# Altium project Open Source Programmable Load.PrjPcb (part 2 of 2)

## Sheet Power.SchDoc
size 431 x 279 mm; SheetNumber: 6; SheetTotal: 6
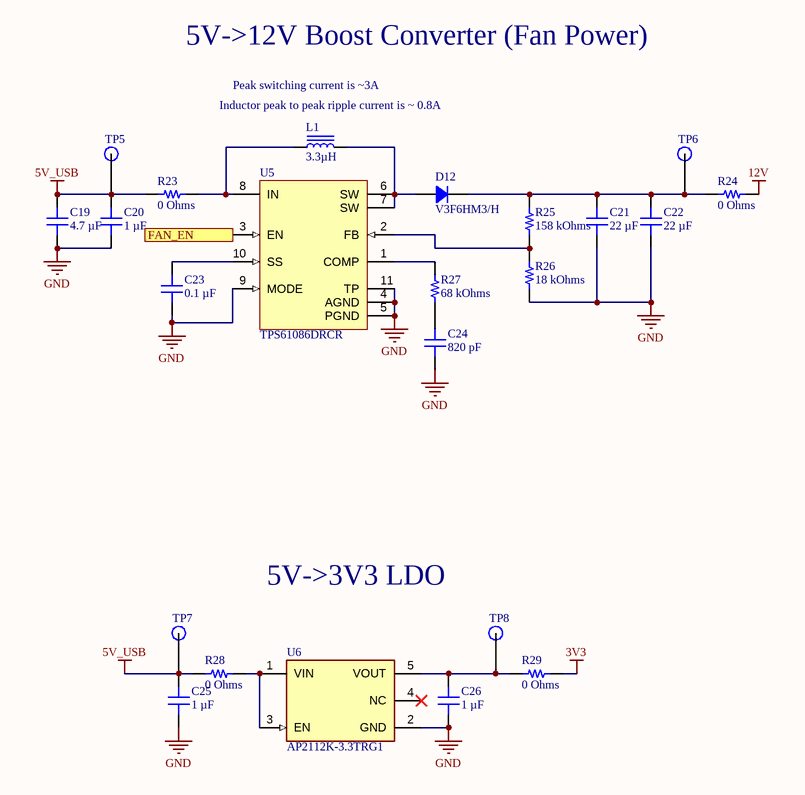
[diagram p4: Power.SchDoc]

### Parts
C19  4.7 µF  [CAP 0603_1608]
C20  1 µF  [CAP 0805_2012]
C21  22 µF  [CAP 1206_3216 - 0.8MM]
C22  22 µF  [CAP 1206_3216 - 0.8MM]
C23  0.1 µF  [CAP 0603_1608]
C24  820 pF  [CAP 0603_1608]
C25  1 µF  [CAP 0603_1608]
C26  1 µF  [CAP 0603_1608]
D12  V3F6HM3/H  [SMF DO-219AB]
L1  3.3µH  [IND 1008_2520]
R23  0 Ohms  [RES 0603_1608]
R24  0 Ohms  [RES 0603_1608]
R25  158 kOhms  [RES 0603_1608]
R26  18 kOhms  [RES 0603_1608]
R27  68 kOhms  [RES 0603_1608]
R28  0 Ohms  [RES 0603_1608]
R29  0 Ohms  [RES 0603_1608]
TP5  1.5mm Test Point  [1mm Test Point-Footprint-1]  (value not drawn)
TP6  1.5mm Test Point  [1mm Test Point-Footprint-1]  (value not drawn)
TP7  1.5mm Test Point  [1mm Test Point-Footprint-1]  (value not drawn)
TP8  1.5mm Test Point  [1mm Test Point-Footprint-1]  (value not drawn)
U5  TPS61086DRCR  [DRC0010A_V]
U6  AP2112K-3.3TRG1  [FP-SOT25-IPC_A]

### Ports
FAN_EN (in)

### Nets
3V3: R29.2
5V_USB: C19.2 C20.2 C25.2 R23.1 R28.1 TP5.1 TP7.1
12V: R24.2
GND: C19.1 C20.1 C21.1 C22.1 C23.1 C24.1 C25.1 C26.1 R26.1 U5.4(AGND) U5.5(PGND) U5.9(MODE) U5.11(TP) U6.2(GND)
NetC21_2: C21.2 C22.2 D12.2 R24.1 R25.2 TP6.1
NetC23_2: C23.2 U5.10(SS)
NetC24_2: C24.2 R27.1
NetC26_2: C26.2 R29.1 TP8.1 U6.5(VOUT)
NetD12_1: D12.1 L1.2 U5.6(SW) U5.7(SW)
NetL1_1: L1.1 R23.2 U5.8(IN)
NetR25_1: R25.1 R26.2 U5.2(FB)
NetR27_2: R27.2 U5.1(COMP)
NetR28_2: R28.2 U6.1(VIN) U6.3(EN)
NetU5_3: U5.3(EN) ; port FAN_EN

Not connected (* = marked no-connect by the designer): U6 4(NC)*

### Notes on the sheet
- 5V->12V Boost Converter (Fan Power)
- (near L1) Inductor peak to peak ripple current is ~ 0.8A
- Peak switching current is ~3A
- 5V->3V3 LDO
- DWG. NO.
- REV.
- SHT.
- THIS DOCUMENT AND THE DATA DISCLOSED HEREIN OR HEREWITH IS THE PROPERTY OF ALTIUM LIMITED AND MAY BE FREELY DISTRIBUTED IN WHOLE. NO RIGHTS ARE RESERVED OR EXPRESS OR IMPLIED WARANTEE GIVEN.
- REVISION
- DESCRIPTION
- DATE
- APPROVED
- ENG:
- APPROVALS
- PROJECT
- DSN:
- CHK:
- REFERENCE DOCUMENTS
- PROJECT REVISION:
- TITLE
- DOCUMENT REVISION:
- DESIGN ITEM:
- BOM:
- FAB DWG:
- PCB DWG:
- ASSY DWG:
- SCALE:
- SIZE
- B
- CAGE CODE
- FILE NAME
- DWG NO.
- SHEET
- OF
- REV

### Library data of the parts
C19 = CL10A475KP8NNNC: CAP CER 4.7UF 10V X5R 0603; manufacturer: Samsung Electro-Mechanics; Tolerance: ±10%; Part Number: CL10A475KP8NNNC; Value: 4.7 µF; Applications: General Purpose; Capacitance: 4.7 µF; componentlink1description: Datasheet; componentlink1url: http://www.samsungsem.com/kr/support/product-search/mlcc/CL10A475KP8NNNC.jsp; componentlink2description: DigiKey Link; componentlink2url: https://www.digikey.com/en/products/detail/samsung-electro-mechanics/CL10A475KP8NNNC/3886702; Device Package: 0603 (1608 Metric); lastupdated: 2022-09-13 6:40:44 AM; Lifecycle Status: Active; Minimum Order: 1; Mounting Type: Surface Mount, MLCC; Operating Temperature: -55°C ~ 85°C; Package / Case: 0603 (1608 Metric); packaging: TapeAndReel; partid: 5671; Part Status: Active; price: 0.01; series: CL; Size / Dimension: 0.063" L x 0.031" W (1.60mm x 0.80mm); Supplier 1: DigiKey; Supplier Part Number 1: 1276-1044-1-ND; Temperature Coefficient: X5R; Thickness (Max): 0.035" (0.90mm); Voltage - Rated: 10V
C20 = GCJ21BR71H105KA01L: CAP CER 1UF 50V X7R 0805; manufacturer: Murata Electronics; Tolerance: ±10%; Part Number: GCJ21BR71H105KA01L; Value: 1 µF; Applications: Automotive, Boardflex Sensitive; Capacitance: 1 µF; componentlink1description: Datasheet; componentlink1url: https://www.murata.com/~/media/webrenewal/support/library/catalog/products/capacitor/mlcc/c03e.ashx?la=en-us; componentlink2description: DigiKey Link; componentlink2url: https://www.digikey.com/en/products/detail/murata-electronics/GCJ21BR71H105KA01L/4903512; Device Package: 0805 (2012 Metric); Features: Soft Termination; lastupdated: 2023-01-02 8:10:56 PM; Lifecycle Status: Active; Minimum Order: 1; Mounting Type: Surface Mount, MLCC; Operating Temperature: -55°C ~ 125°C; Package / Case: 0805 (2012 Metric); packaging: TapeAndReel; partid: 2709; Part Status: Active; price: 0.06; Ratings: AEC-Q200; series: GCJ; Size / Dimension: 0.079" L x 0.049" W (2.00mm x 1.25mm); Supplier 1: DigiKey; Supplier Part Number 1: 490-10667-1-ND; Temperature Coefficient: X7R; Thickness (Max): 0.057" (1.45mm); Voltage - Rated: 50V
C21 C22 = CL31A226MOCLNNC: CAP CER 22UF 16V X5R 1206; manufacturer: Samsung Electro-Mechanics; Tolerance: ±20%; Part Number: CL31A226MOCLNNC; Value: 22 µF; Applications: General Purpose; Capacitance: 22 µF; componentlink1description: Datasheet; componentlink1url: http://www.samsungsem.com/kr/support/product-search/mlcc/CL31A226MOCLNNC.jsp; componentlink2description: DigiKey Link; componentlink2url: https://www.digikey.com/en/products/detail/samsung-electro-mechanics/CL31A226MOCLNNC/3888386; Device Package: 1206 (3216 Metric); Features: Low Profile; lastupdated: 2023-01-02 8:12:59 PM; Lifecycle Status: Active; Minimum Order: 1; Mounting Type: Surface Mount, MLCC; Operating Temperature: -55°C ~ 85°C; Package / Case: 1206 (3216 Metric); packaging: TapeAndReel; partid: 19106; Part Status: Active; price: 0.04; series: CL; Size / Dimension: 0.126" L x 0.063" W (3.20mm x 1.60mm); Supplier 1: DigiKey; Supplier Part Number 1: 1276-2728-1-ND; Temperature Coefficient: X5R; Thickness (Max): 0.037" (0.95mm); Voltage - Rated: 16V
C23 = C0603C104K5RAC7411: CAP CER 0.1UF 50V X7R 0603; manufacturer: KEMET; Tolerance: ±10%; Part Number: C0603C104K5RAC7411; Value: 0.1 µF; Applications: Bypass, Decoupling; Capacitance: 0.1 µF; componentlink1description: Datasheet; componentlink1url: https://api.kemet.com/component-edge/download/datasheet/C0603C104K5RAC7411.pdf; componentlink2description: DigiKey Link; componentlink2url: https://www.digikey.com/en/products/detail/kemet/C0603C104K5RAC7411/3317013; Device Package: 0603 (1608 Metric); lastupdated: 2022-09-13 6:40:53 AM; Lifecycle Status: Active; Minimum Order: 15000; Mounting Type: Surface Mount, MLCC; Operating Temperature: -55°C ~ 125°C; Package / Case: 0603 (1608 Metric); packaging: TapeAndReel; partid: 2233; Part Status: Active; price: 0.01; series: SMD Comm X7R; Size / Dimension: 0.063" L x 0.031" W (1.60mm x 0.80mm); Supplier 1: DigiKey; Supplier Part Number 1: 399-7374-2-ND; Temperature Coefficient: X7R; Thickness (Max): 0.035" (0.90mm); Voltage - Rated: 50V
C24 = C0603C821K5RACAUTO: CAP CER 820PF 50V X7R 0603; manufacturer: KEMET; Tolerance: ±10%; Part Number: C0603C821K5RACAUTO; Value: 820 pF; Applications: Automotive, Bypass, Decoupling; Capacitance: 820 pF; componentlink1description: Datasheet; componentlink1url: https://api.kemet.com/component-edge/download/datasheet/C0603C821K5RACAUTO.pdf; componentlink2description: DigiKey Link; componentlink2url: https://www.digikey.com/en/products/detail/kemet/C0603C821K5RACAUTO/8572435; Device Package: 0603 (1608 Metric); lastupdated: 2023-01-02 8:07:53 PM; Lifecycle Status: Active; Minimum Order: 1; Mounting Type: Surface Mount, MLCC; Operating Temperature: -55°C ~ 125°C; Package / Case: 0603 (1608 Metric); packaging: TapeAndReel; partid: 3747; Part Status: Active; price: 0.01; Ratings: AEC-Q200; series: SMD Auto X7R; Size / Dimension: 0.063" L x 0.031" W (1.60mm x 0.80mm); Supplier 1: DigiKey; Supplier Part Number 1: 399-17600-1-ND; Temperature Coefficient: X7R; Thickness (Max): 0.034" (0.87mm); Voltage - Rated: 50V
C25 C26 = CC0603KRX7R6BB105: CAP CER 1UF 10V X7R 0603; manufacturer: Yageo; Tolerance: ±10%; Part Number: CC0603KRX7R6BB105; Value: 1 µF; Applications: General Purpose; Capacitance: 1 µF; componentlink1description: Datasheet; componentlink1url: https://www.yageo.com/upload/media/product/productsearch/datasheet/mlcc/UPY-GPHC_X7R_6.3V-to-50V_18.pdf; componentlink2description: DigiKey Link; componentlink2url: https://www.digikey.com/en/products/detail/yageo/CC0603KRX7R6BB105/5195204; Device Package: 0603 (1608 Metric); lastupdated: 2022-09-13 6:40:53 AM; Lifecycle Status: Active; Minimum Order: 1; Mounting Type: Surface Mount, MLCC; Operating Temperature: -55°C ~ 125°C; Package / Case: 0603 (1608 Metric); packaging: TapeAndReel; partid: 2290; Part Status: Active; price: 0.02; series: CC; Size / Dimension: 0.063" L x 0.031" W (1.60mm x 0.80mm); Supplier 1: DigiKey; Supplier Part Number 1: 311-1796-1-ND; Temperature Coefficient: X7R; Thickness (Max): 0.035" (0.90mm); Voltage - Rated: 10V
D12 = V3F6HM3/H: 3A,60V,SMF,TRENCH SKY RECT.; Manufacturer: Vishay Semiconductor Diodes Division; Capacitance @ Vr, F: 310pF @ 4V, 1MHz; Current - Reverse Leakage @ Vr: 600µA @ 60V; Diode Type: Schottky; Speed: Fast Recovery =< 500ns, > 200mA (Io); Voltage - Forward (Vf) (Max) @ If: 620mV @ 3A; Part Number: V3F6HM3/H; ComponentLink1Description: Datasheet; ComponentLink1URL: http://www.vishay.com/docs/87565/v3f6.pdf; ComponentLink2Description: DigiKey Link; ComponentLink2URL: http://digikey.com/product-detail/en/vishay-semiconductor-diodes-division/V3F6HM3-H/V3F6HM3-HGICT-ND/9360098; Current - Average Rectified (Io): 3A; LastUpdated: 2023-01-02 9:00:33 PM; Lifecycle Status: Active; Minimum Order: 1; Mounting Type: Surface Mount; Operating Temperature - Junction: -40°C ~ 150°C; Package / Case: DO-219AB; Packaging: TapeAndReel; PartId: 1309; Part Status: Active; Price: 0.11; Series: Automotive, AEC-Q101, eSMP®, TMBS®; Supplier 1: DigiKey; Supplier Part Number 1: V3F6HM3/HGICT-ND; Supplier Device Package: DO-219AB (SMF); Voltage - DC Reverse (Vr) (Max): 60V
L1 = DFE252010F-3R3M=P2: FIXED IND 3.3UH 1.6A 170 MOHM; Manufacturer: Murata Electronics; Current - Saturation: 2.5A; DC Resistance (DCR): 170mOhm Max; Inductance Frequency - Test: 1MHz; Material - Core: Iron Powder; Shielding: Shielded; Tolerance: ±20%; Part Number: DFE252010F-3R3M=P2; ComponentLink1Description: Datasheet; ComponentLink1URL: https://search.murata.co.jp/Ceramy/image/img/P02/J(E)TE243A-0012_DFE252010F_reference.pdf; ComponentLink2Description: DigiKey Link; ComponentLink2URL: http://digikey.com/product-detail/en/murata-electronics/DFE252010F-3R3M=P2/490-13043-1-ND/5812755; Current Rating (Amps): 1.6A; Device Package: 1008 (2520 Metric); Height - Seated (Max): 0.039" (1.00mm); Inductance: 3.3µH; LastUpdated: 2020-09-02 1:29:31 AM; Lifecycle Status: Active; Minimum Order: 1; Mounting Type: Surface Mount; Operating Temperature: -40°C ~ 125°C; Package / Case: 1008 (2520 Metric); Packaging: TapeAndReel; PartId: 3497; Part Status: Active; Price: 0.23; Series: DFE252010F; Size / Dimension: 0.098" L x 0.079" W (2.50mm x 2.00mm); Supplier 1: DigiKey; Supplier Part Number 1: 490-13043-1-ND; Value: 3.3µH
R23 R24 R28 R29 = TLRZ1JTTD: RES 0 OHM JUMPER 0603; Manufacturer: KOA Speer Electronics, Inc.; Part Number: TLRZ1JTTD; Value: 0 Ohms; ComponentLink1Description: Datasheet; ComponentLink1URL: http://www.koaspeer.com/catimages/Products/TLRZ/TLRZ.pdf; ComponentLink2Description: DigiKey Link; ComponentLink2URL: https://www.digikey.com/en/products/detail/koa-speer-electronics-inc/TLRZ1JTTD/9845493; Composition: Metal Element; Device Package: 0603 (1608 Metric); Features: Automotive AEC-Q200, Current Sense; Height - Seated (Max): 0.022" (0.55mm); LastUpdated: 2023-01-02 8:30:27 PM; Lifecycle Status: Active; Minimum Order: 1; Number of Terminations: 2; Operating Temperature: -55°C ~ 170°C; Package / Case: 0603 (1608 Metric); Packaging: TapeAndReel; PartId: 4851; Part Status: Active; Price: 0.08; Ratings: AEC-Q200; Resistance: 0 Ohms; Series: TLRZ; Size / Dimension: 0.063" L x 0.031" W (1.60mm x 0.80mm); Supplier 1: DigiKey; Supplier Part Number 1: 2019-TLRZ1JTTDCT-ND; Supplier Device Package: 0603; Tolerance: Jumper
R25 = RC0603FR-07158KL: RES 158K OHM 1% 1/10W 0603; Manufacturer: Yageo; Power (Watts): 0.1W, 1/10W; Temperature Coefficient: ±100ppm/°C; Part Number: RC0603FR-07158KL; Value: 158 kOhms; ComponentLink1Description: Datasheet; ComponentLink1URL: https://www.yageo.com/upload/media/product/productsearch/datasheet/rchip/PYu-RC_Group_51_RoHS_L_10.pdf; ComponentLink2Description: DigiKey Link; ComponentLink2URL: https://www.digikey.com/en/products/detail/yageo/RC0603FR-07158KL/726963; Composition: Thick Film; Device Package: 0603 (1608 Metric); Features: Moisture Resistant; Height - Seated (Max): 0.022" (0.55mm); LastUpdated: 2023-01-02 8:30:16 PM; Lifecycle Status: Active; Minimum Order: 1; Number of Terminations: 2; Operating Temperature: -55°C ~ 155°C; Package / Case: 0603 (1608 Metric); Packaging: CutTape; PartId: 7687; Part Status: Active; Price: 0.01; Resistance: 158 kOhms; Series: RC_L; Size / Dimension: 0.063" L x 0.031" W (1.60mm x 0.80mm); Supplier 1: DigiKey; Supplier Part Number 1: 311-158KHRCT-ND; Supplier Device Package: 0603; Tolerance: ±1%
R26 = RMCF0603FT18K0: RES 18K OHM 1% 1/10W 0603; Manufacturer: Stackpole Electronics Inc; Power (Watts): 0.1W, 1/10W; Temperature Coefficient: ±100ppm/°C; Part Number: RMCF0603FT18K0; Value: 18 kOhms; ComponentLink1Description: Datasheet; ComponentLink1URL: https://www.seielect.com/catalog/sei-packaging.pdf; ComponentLink2Description: DigiKey Link; ComponentLink2URL: https://www.digikey.com/en/products/detail/stackpole-electronics-inc/RMCF0603FT18K0/1713690; Composition: Thick Film; Device Package: 0603 (1608 Metric); Features: Automotive AEC-Q200; Height - Seated (Max): 0.022" (0.55mm); LastUpdated: 2023-01-02 8:30:03 PM; Lifecycle Status: Active; Minimum Order: 1; Number of Terminations: 2; Operating Temperature: -55°C ~ 155°C; Package / Case: 0603 (1608 Metric); Packaging: CutTape; PartId: 10797; Part Status: Active; Price: 0.01; Ratings: AEC-Q200; Resistance: 18 kOhms; Series: RMCF; Size / Dimension: 0.061" L x 0.031" W (1.55mm x 0.80mm); Supplier 1: DigiKey; Supplier Part Number 1: RMCF0603FT18K0CT-ND; Supplier Device Package: 0603; Tolerance: ±1%
R27 = CRGP0603F68K: RES 68K OHM 1% 1/4W 0603; Manufacturer: TE Connectivity Passive Product; Power (Watts): 0.25W, 1/4W; Temperature Coefficient: ±100ppm/°C; Part Number: CRGP0603F68K; Value: 68 kOhms; ComponentLink1Description: Datasheet; ComponentLink1URL: https://www.te.com/commerce/DocumentDelivery/DDEController?Action=srchrtrv&DocNm=9-1773463-9&DocType=DS&DocLang=English; ComponentLink2Description: DigiKey Link; ComponentLink2URL: https://www.digikey.com/en/products/detail/te-connectivity-passive-product/CRGP0603F68K/8577040; Composition: Thick Film; Device Package: 0603 (1608 Metric); Features: Pulse Withstanding; Height - Seated (Max): 0.022" (0.55mm); LastUpdated: 2023-01-02 8:30:26 PM; Lifecycle Status: Active; Minimum Order: 1; Number of Terminations: 2; Operating Temperature: -55°C ~ 155°C; Package / Case: 0603 (1608 Metric); Packaging: TapeAndReel; PartId: 5012; Part Status: Active; Price: 0.01; Resistance: 68 kOhms; Series: CRGP; Size / Dimension: 0.063" L x 0.031" W (1.60mm x 0.80mm); Supplier 1: DigiKey; Supplier Part Number 1: A130438CT-ND; Supplier Device Package: 0603; Tolerance: ±1%
TP5-TP8 = CMP-002-00006-1: 1.5mm Test Point 0.75mm hole size
U5 = CMP-0347-00018-4: Boost Voltage Converter with 2.3 to 6 V Input and 2.8 to 18.5 V Output, -40 to 85 degC, 10-Pin SON (DRC), Green (RoHS & no Sb/Br); Manufacturer: Texas Instruments; Vin(Min)(V): 2.3; Vout(Min)(V): 2.8; Regulated Outputs(#): 1; Vout(Max)(V): 18.5; Switching Frequency(Typ)(kHz): 1200; Vin(Max)(V): 6; SubFamily: Step-Up Regulator; PackageDescription: 10-Pin Plastic Small Outline No-Lead, 3 x 3 x 1 mm Body, 0.5 mm Pitch, Exposed Pad; PartNumber: TPS61086DRCR; ComponentLink1URL: http://www.ti.com/general/docs/lit/getliterature.tsp?genericPartNumber=TPS61086&fileType=pdf; ComponentLink2URL: http://www.ti.com/litv/pdf/mpds117k; PackageReference: DRC0010A; PackageVersion: revL, Sep-2011; ComponentLink1Description: Datasheet; Mounting Technology: Surface Mount; Topology: Boost; Eco-Plan: Green (RoHS & no Sb/Br); DatasheetVersion: SLVSA05; ComponentLink2Description: Package Specification
U6 = CMP-12756-000035-1: IC REG LINEAR 3.3V 600MA SOT25; Number of Regulators: 1; Output Type: Fixed; Polarity: Positive; Min Input Voltage: 2.5V; Max Input Voltage: 6V; Accuracy: 1.5%; Quiescent Current: 55uA; Dropout Voltage: 250mV; Min Operating Temperature: -40°C; Length: 3.1mm; Output Current: 600mA; Max Operating Temperature: 85°C; Package Quantity: 1; Output Voltage: 3.3V; Width: 1.7mm; Number of Outputs: 1; Packaging: Tape and Reel; Height: 1.3mm; Lead Free: Lead Free; Max Output Current: 600mA; Case/Package: SOT-23-5; Mount: Surface Mount; Number of Pins: 5

## Sheet Fan Driver.SchDoc
size 431 x 279 mm; SheetNumber: 4; SheetTotal: 6
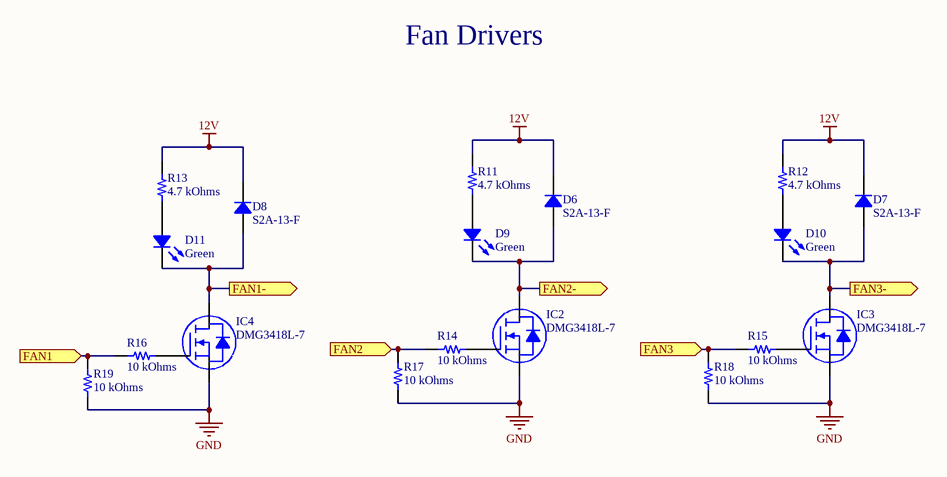
[diagram p5: Fan Driver.SchDoc]

### Parts
D6  S2A-13-F  [DO214AA SMB]
D7  S2A-13-F  [DO214AA SMB]
D8  S2A-13-F  [DO214AA SMB]
D9  Green  [LED 0603_1608 GREEN]
D10  Green  [LED 0603_1608 GREEN]
D11  Green  [LED 0603_1608 GREEN]
IC2  DMG3418L-7  [DIODES SOT-23-3]
IC3  DMG3418L-7  [DIODES SOT-23-3]
IC4  DMG3418L-7  [DIODES SOT-23-3]
R11  4.7 kOhms  [RES 0603_1608]
R12  4.7 kOhms  [RES 0603_1608]
R13  4.7 kOhms  [RES 0603_1608]
R14  10 kOhms  [RES 0603_1608]
R15  10 kOhms  [RES 0603_1608]
R16  10 kOhms  [RES 0603_1608]
R17  10 kOhms  [RES 0603_1608]
R18  10 kOhms  [RES 0603_1608]
R19  10 kOhms  [RES 0603_1608]

### Ports
FAN1 (in), FAN1- (out), FAN2 (in), FAN2- (out), FAN3 (in), FAN3- (out)

### Nets
12V: D6.2 D7.2 D8.2 R11.2 R12.2 R13.2
GND: IC2.2(S) IC3.2(S) IC4.2(S) R17.1 R18.1 R19.1
NetD6_1: D6.1 D9.2 IC2.3(D) ; port FAN2-
NetD7_1: D7.1 D10.2 IC3.3(D) ; port FAN3-
NetD8_1: D8.1 D11.2 IC4.3(D) ; port FAN1-
NetD9_1: D9.1 R11.1
NetD10_1: D10.1 R12.1
NetD11_1: D11.1 R13.1
NetIC2_1: IC2.1(G) R14.1
NetIC3_1: IC3.1(G) R15.1
NetIC4_1: IC4.1(G) R16.1
NetR14_2: R14.2 R17.2 ; port FAN2
NetR15_2: R15.2 R18.2 ; port FAN3
NetR16_2: R16.2 R19.2 ; port FAN1

### Notes on the sheet
- Fan Drivers
- DWG. NO.
- REV.
- SHT.
- THIS DOCUMENT AND THE DATA DISCLOSED HEREIN OR HEREWITH IS THE PROPERTY OF ALTIUM LIMITED AND MAY BE FREELY DISTRIBUTED IN WHOLE. NO RIGHTS ARE RESERVED OR EXPRESS OR IMPLIED WARANTEE GIVEN.
- REVISION
- DESCRIPTION
- DATE
- APPROVED
- ENG:
- APPROVALS
- PROJECT
- DSN:
- CHK:
- REFERENCE DOCUMENTS
- PROJECT REVISION:
- TITLE
- DOCUMENT REVISION:
- DESIGN ITEM:
- BOM:
- FAB DWG:
- PCB DWG:
- ASSY DWG:
- SCALE:
- SIZE
- B
- CAGE CODE
- FILE NAME
- DWG NO.
- SHEET
- OF
- REV

### Library data of the parts
D6-D8 = S2A-13-F: DIODE GEN PURP 50V 1.5A SMB; Manufacturer: Diodes Incorporated; Capacitance @ Vr, F: 20pF @ 4V, 1MHz; Current - Reverse Leakage @ Vr: 5 µA @ 50 V; Diode Type: Standard; Speed: Standard Recovery >500ns, > 200mA (Io); Voltage - Forward (Vf) (Max) @ If: 1.15 V @ 1.5 A; Part Number: S2A-13-F; ComponentLink1Description: Datasheet; ComponentLink1URL: https://www.diodes.com/assets/Datasheets/ds16004.pdf; ComponentLink2Description: DigiKey Link; ComponentLink2URL: https://www.digikey.com/en/products/detail/diodes-incorporated/S2A-13-F/814429; Current - Average Rectified (Io): 1.5A; LastUpdated: 2022-09-19 1:45:35 PM; Lifecycle Status: Active; Minimum Order: 1; Mounting Type: Surface Mount; Operating Temperature - Junction: -65°C ~ 150°C; Package / Case: DO-214AA, SMB; Packaging: TapeAndReel; PartId: 302; Part Status: Active; Price: 0.05; Series: -; Supplier 1: DigiKey; Supplier Part Number 1: S2A-FDICT-ND; Supplier Device Package: SMB; Voltage - DC Reverse (Vr) (Max): 50 V
D9-D11 = XZVGT53W-6: LED GREEN CLEAR 2SMD; Manufacturer: SunLED; Configuration: Standard; Current - Test: 20mA; Lens Color: Colorless; Lens Size: 1.20mm x 0.80mm; Lens Style: Rectangle with Flat Top; Millicandela Rating: 49mcd; Viewing Angle: 120°; Voltage - Forward (Vf) (Typ): 2.1V; Wavelength - Dominant: 570nm; Wavelength - Peak: 574nm; Part Number: XZVGT53W-6; Color: Green; ComponentLink1Description: Datasheet; ComponentLink1URL: https://www.sunledusa.com/products/spec/XZVGT53W-6.pdf; ComponentLink2Description: DigiKey Link; ComponentLink2URL: https://www.digikey.com/en/products/detail/sunled/XZVGT53W-6/4902128; Device Package: 0603 (1608 Metric); Height (Max): 0.28mm; LastUpdated: 2022-09-13 7:29:38 AM; Lens Transparency: Clear; Lifecycle Status: Active; Minimum Order: 1; Mounting Type: Surface Mount; Package / Case: 0603 (1608 Metric); Packaging: TapeAndReel; PartId: 581; Part Status: Active; Price: 0.05; Series: -; Size / Dimension: 1.60mm L x 0.80mm W; Supplier 1: DigiKey; Supplier Part Number 1: 1497-1243-1-ND; Supplier Device Package: 2-SMD; Value: Green
IC2-IC4 = DMG3418L-7: MOSFET N-CH 30V 4A SOT23; Manufacturer: Diodes Incorporated; Current - Continuous Drain (Id) @ 25°C: 4A (Ta); Drive Voltage (Max Rds On,  Min Rds On): 2.5V, 10V; FET Type: N-Channel; Gate Charge (Qg) (Max) @ Vgs: 5.5 nC @ 4.5 V; Input Capacitance (Ciss) (Max) @ Vds: 464.3 pF @ 15 V; Power Dissipation (Max): 1.4W (Ta); Rds On (Max) @ Id, Vgs: 60mOhm @ 4A, 10V; Vgs (Max): ±12V; Vgs(th) (Max) @ Id: 1.5V @ 250µA; Part Number: DMG3418L-7; ComponentLink1Description: Datasheet; ComponentLink1URL: https://www.diodes.com/assets/Datasheets/DMG3418L.pdf; ComponentLink2Description: DigiKey Link; ComponentLink2URL: https://www.digikey.com/en/products/detail/diodes-incorporated/DMG3418L-7/4810932; Drain to Source Voltage (Vdss): 30 V; LastUpdated: 2022-09-19 2:00:12 PM; Lifecycle Status: Active; Minimum Order: 1; Mounting Type: Surface Mount; Operating Temperature: -55°C ~ 150°C (TJ); Package / Case: TO-236-3, SC-59, SOT-23-3; Packaging: TapeAndReel; Part Status: Active; Price: 0.09; Series: -; Supplier 1: DigiKey; Supplier Part Number 1: DMG3418L-7DICT-ND; Supplier Device Package: SOT-23-3; Technology: MOSFET (Metal Oxide)
R11-R13 = ERJ-3EKF4701V: RES SMD 4.7K OHM 1% 1/10W 0603; Manufacturer: Panasonic Electronic Components; Power (Watts): 0.1W, 1/10W; Temperature Coefficient: ±100ppm/°C; Part Number: ERJ-3EKF4701V; Value: 4.7 kOhms; ComponentLink1Description: Datasheet; ComponentLink1URL: https://industrial.panasonic.com/cdbs/www-data/pdf/RDA0000/AOA0000C304.pdf; ComponentLink2Description: DigiKey Link; ComponentLink2URL: https://www.digikey.com/en/products/detail/panasonic-electronic-components/ERJ-3EKF4701V/1746419; Composition: Thick Film; Device Package: 0603 (1608 Metric); Features: Automotive AEC-Q200; Height - Seated (Max): 0.022" (0.55mm); LastUpdated: 2022-09-19 1:22:31 PM; Lifecycle Status: Active; Minimum Order: 1; Number of Terminations: 2; Operating Temperature: -55°C ~ 155°C; Package / Case: 0603 (1608 Metric); Packaging: TapeAndReel; PartId: 5645; Part Status: Active; Price: 0.01; Ratings: AEC-Q200; Resistance: 4.7 kOhms; Series: ERJ-3EK; Size / Dimension: 0.063" L x 0.031" W (1.60mm x 0.80mm); Supplier 1: DigiKey; Supplier Part Number 1: P4.70KHCT-ND; Supplier Device Package: 0603; Tolerance: ±1%
R14-R19 = RT0603FRE0710KL: RES SMD 10K OHM 1% 1/10W 0603; Manufacturer: Yageo; Power (Watts): 0.1W, 1/10W; Temperature Coefficient: ±50ppm/°C; Part Number: RT0603FRE0710KL; Value: 10 kOhms; ComponentLink1Description: Datasheet; ComponentLink1URL: https://www.yageo.com/upload/media/product/productsearch/datasheet/rchip/PYu-RT_1-to-0.01_RoHS_L_11.pdf; ComponentLink2Description: DigiKey Link; ComponentLink2URL: https://www.digikey.com/en/products/detail/yageo/RT0603FRE0710KL/1075040; Composition: Thin Film; Device Package: 0603 (1608 Metric); Height - Seated (Max): 0.022" (0.55mm); LastUpdated: 2022-09-19 1:22:31 PM; Lifecycle Status: Active; Minimum Order: 1; Number of Terminations: 2; Operating Temperature: -55°C ~ 155°C; Package / Case: 0603 (1608 Metric); Packaging: TapeAndReel; PartId: 5671; Part Status: Active; Price: 0.01; Resistance: 10 kOhms; Series: RT; Size / Dimension: 0.063" L x 0.031" W (1.60mm x 0.80mm); Supplier 1: DigiKey; Supplier Part Number 1: YAG2321CT-ND; Supplier Device Package: 0603; Tolerance: ±1%

## Nets that join several sheets
3V3: Microcontroller (12 pins), Programmable Load (C18.2 C?.2 U2.5), Power (R29.2)
5V_USB: Top Level (J1.1), USB Communication (6 pins), Power (7 pins)
12V: Power (R24.2), Fan Driver (6 pins)
GND: Top Level (J1.4 J1.S), Microcontroller (20 pins), Programmable Load (5 pins), USB Communication (7 pins), Power (14 pins), Fan Driver (6 pins)

## Assembly variants
Open Source Programmable Load Main PCBA Rev A: all parts fitted